# EAGLE design mapleCUx_large_052 (EAGLE 7.3.0)
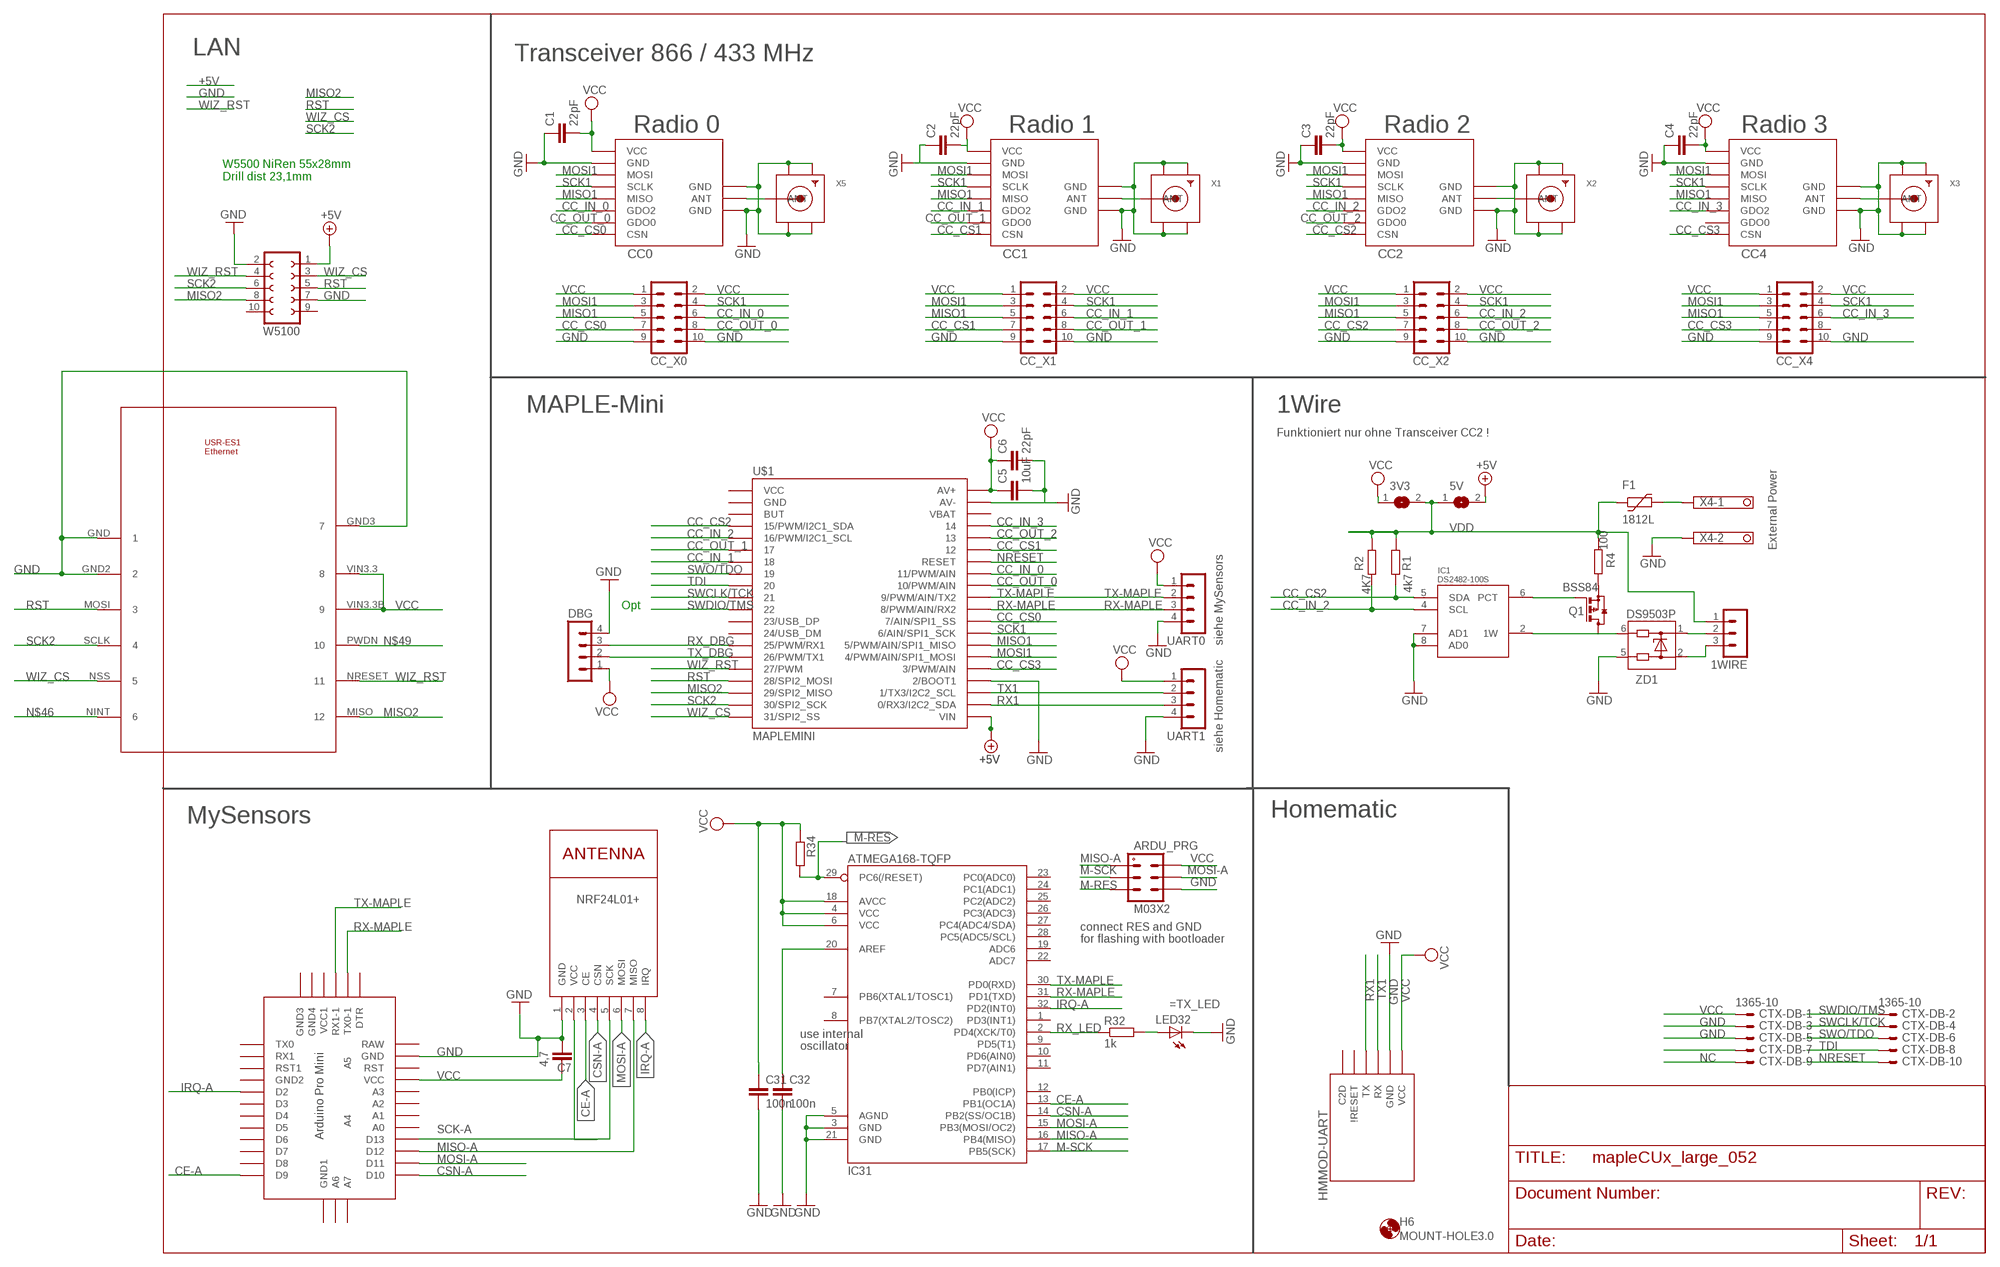
[diagram p0: schematic, sheet 1]

## Parts
1WIRE  MA03-1  [MA03-1]
3V3  SJ  [SJ]
5V  SJ  [SJ]
ARDU_PRG  M03X2  [2X03-1.27MM_SMD]
C1  22pF  C-EUC0805  [C0805]
C2  22pF  C-EUC0805  [C0805]
C3  22pF  C-EUC0805  [C0805]
C4  22pF  C-EUC0805  [C0805]
C5  10uF  C-EUC1210  [C1210]
C6  22pF  C-EUC0805  [C0805]
C7  4,7  C-EUC1210  [C1210]
C31  100n  C-EUC0805  [C0805]
C32  100n  C-EUC0805  [C0805]
CC0  CC1101_MODULE1SMD  [CC1101_MODULE1_SMD]
CC1  CC1101_MODULE1SMD  [CC1101_MODULE1_SMD]
CC2  CC1101_MODULE1SMD  [CC1101_MODULE1_SMD]
CC4  CC1101_MODULE1SMD  [CC1101_MODULE1_SMD]
CC_X0  MA05-2  [MA05-2]
CC_X1  MA05-2  [MA05-2]
CC_X2  MA05-2  [MA05-2]
CC_X4  MA05-2  [MA05-2]
CTX-DB  1365-10  [1365-10]
DBG  MA04-1  [MA04-1]
F1  1812L  [1812L]
H6  MOUNT-HOLE3.0  [3,0]
HMMOD-UART  HM-MOD-UARTDIL  [HM-MOD-UART-DIL]
IC1  DS2482-100S  [SO08]
IC31  ATMEGA168-TQFP  [TQFP32-08]
LED32  LEDCHIPLED_0805  [CHIPLED_0805]
NRF24L01+  NRF24L01+  WIRELESS-NRF24L01  [WIRELESS-NRF24L01]
Q1  BSS84  [SOT23]
R1  4k7  R-EU_R0805  [R0805]
R2  4K7  R-EU_R0805  [R0805]
R4  100  R-EU_R0805  [R0805]
R32  1k  R-EU_R0805  [R0805]
R34  R-EU_R0805  [R0805]
U$1  MAPLEMINI  [20-DIP]
U$2  ABK-PRO-MINI  [ABK-PRO-MINI]
U$3  USR-ES1  [USR-ES1]
UART0  MA04-1  [MA04-1]
UART1  MA04-1  [MA04-1]
W5100  FE05-2  [FE05-2]
X1  SMACONNECTOR_EDGE_UFL  [SMA_EDGELAUNCH_UFL]
X2  SMACONNECTOR_EDGE_UFL  [SMA_EDGELAUNCH_UFL]
X3  SMACONNECTOR_EDGE_UFL  [SMA_EDGELAUNCH_UFL]
X4  1751248  [1751248]
X5  SMACONNECTOR_EDGE_UFL  [SMA_EDGELAUNCH_UFL]
ZD1  DS9503P  [TSOC6]

## Nets
+5V [PWR]: 5V.2 U$1.21(VIN) W5100.1
CC_CS0: CC0.CSN CC_X0.7 U$1.29(7/AIN/SPI1_SS)
CC_CS1: CC1.CSN CC_X1.7 U$1.35
CC_CS2: CC2.CSN CC_X2.7 IC1.5(SDA) R1.2 U$1.4(15/PWM/I2C1_SDA)
CC_CS3: CC4.CSN CC_X4.7 U$1.25(3/PWM/AIN)
CC_IN_0: CC0.GDO2 CC_X0.6 U$1.33(11/PWM/AIN)
CC_IN_1: CC1.GDO2 CC_X1.6 U$1.7
CC_IN_2: CC2.GDO2 CC_X2.6 IC1.4(SCL) R2.2 U$1.5(16/PWM/I2C1_SCL)
CC_IN_3: CC4.GDO2 CC_X4.6 U$1.37
CC_OUT_0: CC0.GDO0 CC_X0.8 U$1.32(10/PWM/AIN)
CC_OUT_1: CC1.GDO0 CC_X1.8 U$1.6
CC_OUT_2: CC2.GDO0 CC_X2.8 U$1.36
CE-A: IC31.13(PB1(OC1A)) NRF24L01+.3(CE) U$2.D9
CSN-A: IC31.14(PB2(SS/OC1B)) NRF24L01+.4(CSN) U$2.D10
GND [PWR]: ARDU_PRG.P$6 C1.1 C2.1 C3.1 C4.1 C5.2 C6.2 C7.1 C31.2 C32.2 CC0.GND@0(GND) CC0.GND@1(GND) CC0.GND@2(GND) CC1.GND@0(GND) CC1.GND@1(GND) CC1.GND@2(GND) CC2.GND@0(GND) CC2.GND@1(GND) CC2.GND@2(GND) CC4.GND@0(GND) CC4.GND@1(GND) CC4.GND@2(GND) CC_X0.9 CC_X0.10 CC_X1.9 CC_X1.10 CC_X2.9 CC_X2.10 CC_X4.9 CC_X4.10 CTX-DB.3 CTX-DB.5 DBG.4 HMMOD-UART.2(GND) IC1.7(AD1) IC1.8(AD0) IC31.3(GND) IC31.5(AGND) IC31.21(GND) LED32.C NRF24L01+.1(GND) U$1.24(2/BOOT1) U$1.39(AV-) U$2.GND U$3.GND U$3.GND2 U$3.GND3 UART0.4 UART1.4 W5100.2 W5100.7 X1.GND@1(GND1) X1.GND@2(GND2) X1.GND@3(GND3) X1.GND@4(GND4) X2.GND@1(GND1) X2.GND@2(GND2) X2.GND@3(GND3) X2.GND@4(GND4) X3.GND@1(GND1) X3.GND@2(GND2) X3.GND@3(GND3) X3.GND@4(GND4) X4.2 X5.GND@1(GND1) X5.GND@2(GND2) X5.GND@3(GND3) X5.GND@4(GND4) ZD1.5
IRQ-A: IC31.32(PD2(INT0)) NRF24L01+.8(IRQ) U$2.D2
M-RES: ARDU_PRG.P$5 IC31.29(PC6(/RESET)) R34.2
M-SCK: ARDU_PRG.P$3 IC31.17(PB5(SCK))
MISO1: CC0.MISO CC1.MISO CC2.MISO CC4.MISO CC_X0.5 CC_X1.5 CC_X2.5 CC_X4.5 U$1.27(5/PWM/AIN/SPI1_MISO)
MISO2: U$1.18(29/SPI2_MISO) U$3.MISO W5100.8
MISO-A: ARDU_PRG.P$1 IC31.16(PB4(MISO)) NRF24L01+.7(MISO) U$2.D12
MOSI1: CC0.MOSI CC1.MOSI CC2.MOSI CC4.MOSI CC_X0.3 CC_X1.3 CC_X2.3 CC_X4.3 U$1.26(4/PWM/AIN/SPI1_MOSI)
MOSI-A: ARDU_PRG.P$4 IC31.15(PB3(MOSI/OC2)) NRF24L01+.6(MOSI) U$2.D11
N$1: CC1.ANT X1.P(ANT)
N$2: CC4.ANT X3.P(ANT)
N$3: CC2.ANT X2.P(ANT)
N$4: CC0.ANT X5.P(ANT)
N$5: LED32.A R32.2
N$8: CTX-DB.7
N$15: C32.1 IC31.20(AREF)
N$21: 1WIRE.2 ZD1.1
N$45 [PWR]: F1.P$2 X4.1
N$46: U$3.NINT
N$47: IC1.6(PCT) Q1.1(G)
N$48: IC1.2(1W) Q1.3(D) ZD1.6
N$49: U$3.PWDN
N$51 [PWR]: 1WIRE.3 ZD1.2
N$52: Q1.2(S) R4.1
NC: CTX-DB.9
NRESET: CTX-DB.10 U$1.34(RESET)
RST: U$1.17(28/SPI2_MOSI) U$3.MOSI W5100.5
RX1: HMMOD-UART.5(TX) U$1.22(0/RX3/I2C2_SDA) UART1.3
RX-MAPLE: IC31.31(PD1(TXD)) U$1.30(8/PWM/AIN/RX2) U$2.TX0-1 UART0.3
RX_DBG: DBG.3 U$1.14(25/PWM/RX1)
RX_LED: IC31.2(PD4(XCK/T0)) R32.1
SCK1: CC0.SCLK CC1.SCLK CC2.SCLK CC4.SCLK CC_X0.4 CC_X1.4 CC_X2.4 CC_X4.4 U$1.28(6/AIN/SPI1_SCK)
SCK2: U$1.19(30/SPI2_SCK) U$3.SCLK W5100.6
SCK-A: NRF24L01+.5(SCK) U$2.D13
SWCLK/TCK: CTX-DB.4 U$1.10
SWDIO/TMS: CTX-DB.2 U$1.11
SWO/TDO: CTX-DB.6 U$1.8
TDI: CTX-DB.8 U$1.9
TX1: HMMOD-UART.6(RX) U$1.23(1/TX3/I2C2_SCL) UART1.2
TX-MAPLE: IC31.30(PD0(RXD)) U$1.31(9/PWM/AIN/TX2) U$2.RX1-1 UART0.2
TX_DBG: DBG.2 U$1.15(26/PWM/TX1)
VCC [PWR]: 3V3.1 ARDU_PRG.P$2 C1.2 C2.2 C3.2 C4.2 C5.1 C6.1 C7.2 C31.1 CC0.VCC CC1.VCC CC2.VCC CC4.VCC CC_X0.1 CC_X0.2 CC_X1.1 CC_X1.2 CC_X2.1 CC_X2.2 CC_X4.1 CC_X4.2 CTX-DB.1 DBG.1 HMMOD-UART.1(VCC) IC31.4(VCC) IC31.6(VCC) IC31.18(AVCC) NRF24L01+.2(VCC) R34.1 U$1.40(AV+) U$2.VCC U$3.VIN3.3 U$3.VIN3.3B UART0.1 UART1.1
VDD [PWR]: 1WIRE.1 3V3.2 5V.1 F1.P$1 R1.1 R2.1 R4.2
WIZ_CS: U$1.20(31/SPI2_SS) U$3.NSS W5100.3
WIZ_RST: U$1.16(27/PWM) U$3.NRESET W5100.4
Unconnected: CC4.GDO0 CC_X4.8 HMMOD-UART.3(C2D) HMMOD-UART.4(\!RESET) IC31.1(PD3(INT1)) IC31.7(PB6(XTAL1/TOSC1)) IC31.8(PB7(XTAL2/TOSC2)) IC31.9(PD5(T1)) IC31.10(PD6(AIN0)) IC31.11(PD7(AIN1)) IC31.12(PB0(ICP)) IC31.19(ADC6) IC31.22(ADC7) IC31.23(PC0(ADC0)) IC31.24(PC1(ADC1)) IC31.25(PC2(ADC2)) IC31.26(PC3(ADC3)) IC31.27(PC4(ADC4/SDA)) IC31.28(PC5(ADC5/SCL)) U$1.1(VCC) U$1.2(GND) U$1.3(BUT) U$1.12(23/USB_DP) U$1.13(24/USB_DM) U$1.38(VBAT) U$2.A0 U$2.A1 U$2.A2 U$2.A3 U$2.A4 U$2.A5 U$2.A6 U$2.A7 U$2.D3 U$2.D4 U$2.D5 U$2.D6 U$2.D7 U$2.D8 U$2.DTR U$2.GND1(GND2) U$2.GND2(GND3) U$2.GND3(GND4) U$2.GND4(GND1) U$2.RAW U$2.RST U$2.RST1 U$2.RX1 U$2.TX0 U$2.VCC1 W5100.9 W5100.10

## Notes on the sheet
- LAN | Transceiver 866 / 433 MHz
- Radio 0 | Radio 1 | Radio 2 | Radio 3
- W5500 NiRen 55x28mm
  Drill dist 23,1mm
- MAPLE-Mini | 1Wire
- Funktioniert nur ohne Transceiver CC2 !
- External Power
- Opt
- siehe MySensors
- siehe Homematic
- MySensors | Homematic
- connect RES and GND
- for flashing with bootloader
- =TX_LED
- use internal
- oscillator

## Power pins joined to a net without a drawn wire
GND: IC1.3(GND)
VDD: IC1.1(VDD)

## Library data of the parts
1WIRE = con-lstb:MA03-1: PIN HEADER; OC_FARNELL: unknown; OC_NEWARK: unknown
3V3 5V = jumper:SJ: SMD solder JUMPER
ARDU_PRG = mechanics:M03X2
C1-C7 C31 C32 = rcl:C-EU: CAPACITOR, European symbol
CC0 CC1 CC2 CC4 = wireless:CC1101_MODULE1: CC1101 wireless module for 433/868 MHz (sold from Aliexpress). DIL version for mounting with pin header (and SMD soldering) and SMD only variant available.
CC_X0 CC_X1 CC_X2 CC_X4 = con-lstb:MA05-2: PIN HEADER; OC_FARNELL: unknown; OC_NEWARK: unknown
CTX-DB = con-leotronics:1365-10: DUAL ROW STRAIGHT HEADER 1364 SERIES. 1.27mm x 1.27mm. Without Fixing Post. SMT Source: http://www.leotronics.co.uk/Conexcon/Data%20Sheets/sec.%20A/1364ing.pdf; OC_FARNELL: unknown; OC_NEWARK: unknown
DBG UART0 UART1 = con-lstb:MA04-1: PIN HEADER; OC_FARNELL: unknown; OC_NEWARK: unknown
F1 = ptc-littlefuse:1812L
H6 = holes:MOUNT-HOLE: MOUNTING HOLE with drill center marker
HMMOD-UART = wireless:HM-MOD-UART: eQ3 HM-MOD-UART-AW-SH2 wireless module for 868 MHz. DIL version for mounting with pin header (antenna upwards) and SMD variant available (antenna downwards).
IC1 = 1wire:DS2482-100: I2C to 1-Wire Host Adapter/Line Driver This device is a onewire host and I2C interface in one chip. It provides the complete DC/AC requirements for onewire communication, including overdrive speed mode, but, unlike the DS2480B chip, no 12V EPROM programming. Notes: For overdrive speed and 5V EEPROM programming, an external active pullup circuit must be connected to the 1W, VDD and PCT pin. See the datasheet for details. The lower two I2C adress bits of the chip can be selected by external pins, so up to 4 chips may be connected to the same I2C bus. Author: Orginal device and description from Giovanni Varasano <giovanni.varasano@fastwebnet.it> Improved by Jan Kandziora <jjj@gmx.de>
IC31 = atmel:ATMEGA168: Atmel Atmega 168/328/328P
LED32 = led:LED: LED OSRAM: - CHIPLED LG R971, LG N971, LY N971, LG Q971, LY Q971, LO R971, LY R971 LH N974, LH R974 LS Q976, LO Q976, LY Q976 LO Q996 - Hyper CHIPLED LW Q18S LB Q993, LB Q99A, LB R99A - SideLED LS A670, LO A670, LY A670, LG A670, LP A670 LB A673, LV A673, LT A673, LW A673 LH A674 LY A675 LS A676, LA A676, LO A676, LY A676, LW A676 LS A679, LY A679, LG A679 - Hyper Micro SIDELED® LS Y876, LA Y876, LO Y876, LY Y876 LT Y87S - SmartLED LW L88C, LW L88S LB L89C, LB L89S, LG L890 LS L89K, LO L89K, LY L89K LS L896, LA L896, LO L896, LY L896 - TOPLED LS T670, LO T670, LY T670, LG T670, LP T670 LSG T670, LSP T670, LSY T670, LOP T670, LYG T670 LG T671, LOG T671, LSG T671 LB T673, LV T673, LT T673, LW T673 LH T674 LS T676, LA T676, LO T676, LY T676, LB T676, LH T676, LSB T676, LW T676 LB T67C, LV T67C, LT T67C, LS T67K, LO T67K, LY T67K, LW E67C LS E67B, LA E67B, LO E67B, LY E67B, LB E67C, LV E67C, LT E67C LW T67C LS T679, LY T679, LG T679 LS T770, LO T770, LY T770, LG T770, LP T770 LB T773, LV T773, LT T773, LW T773 LH T774 LS E675, LA E675, LY E675, LS T675 LS T776, LA T776, LO T776, LY T776, LB T776 LHGB T686 LT T68C, LB T68C - Hyper Mini TOPLED® LB M676 - Mini TOPLED Santana® LG M470 LS M47K, LO M47K, LY M47K Source: http://www.osram.convergy.de LUXEON: - LUMILED® LXK2-PW12-R00, LXK2-PW12-S00, LXK2-PW14-U00, LXK2-PW14-V00 LXK2-PM12-R00, LXK2-PM12-S00, LXK2-PM14-U00 LXK2-PE12-Q00, LXK2-PE12-R00, LXK2-PE12-S00, LXK2-PE14-T00, LXK2-PE14-U00 LXK2-PB12-K00, LXK2-PB12-L00, LXK2-PB12-M00, LXK2-PB14-N00, LXK2-PB14-P00, LXK2-PB14-Q00 LXK2-PR12-L00, LXK2-PR12-M00, LXK2-PR14-Q00, LXK2-PR14-R00 LXK2-PD12-Q00, LXK2-PD12-R00, LXK2-PD12-S00 LXK2-PH12-R00, LXK2-PH12-S00 LXK2-PL12-P00, LXK2-PL12-Q00, LXK2-PL12-R00 Source: www.luxeon.com KINGBRIGHT: KA-3528ASYC Source: www.kingbright.com
NRF24L01+ = diy-modules:WIRELESS-NRF24L01: 2.4 GHz Wireless Module based on NRF24L01 chip
Q1 = transistor-small-signal:BSS84: P-CHANNEL MOS FET
R1 R2 R4 R32 R34 = rcl:R-EU_: RESISTOR, European symbol
U$1 = maplemini-small:MAPLEMINI
U$2 = Arduino-clone:ABK-PRO-MINI: ABK Pro-Mini Arduino Clone
U$3 = Martin:USR-ES1: W5500 LAN Module
W5100 = con-lsta:FE05-2: FEMALE HEADER; OC_FARNELL: unknown; OC_NEWARK: unknown
X1-X3 X5 = adafruit:SMACONNECTOR: SMA Connector 90° DIP SMA Connector, 50 Ohm (4UConnector: 07259)
X4 = con-phoenix-350:1751248: MKDS 1/ 2-3,5 Printklemme Nennstrom: 10 A Bemessungsspannung: 160 V Raster: 3,5 mm Polzahl: 2 Montageart: Löten Anschlussart: Schraubanschluss Anschlussrichtung vom Leiter zur Platine: 0° Source: http://eshop.phoenixcontact.com .. 1751248.pdf; OC_FARNELL: unknown; OC_NEWARK: unknown
ZD1 = 1wire:DS9503: ESD Protection Diode with Resistors This ESD protection diode is designed especially for onewire host interfaces. Unlike the DS9502, it has two additional 5Ohm resitors in the 1W and GND line. Pin 5 and 6 have to be connected to the host side, pin 1 und 2 to the network side. The 1W line is through pin 1 and 6, the GND line is through pin 2 and 5. Author: Jan Kandziora <jjj@gmx.de>

## Net classes
1 PWR: width 0.508 mm

## Board
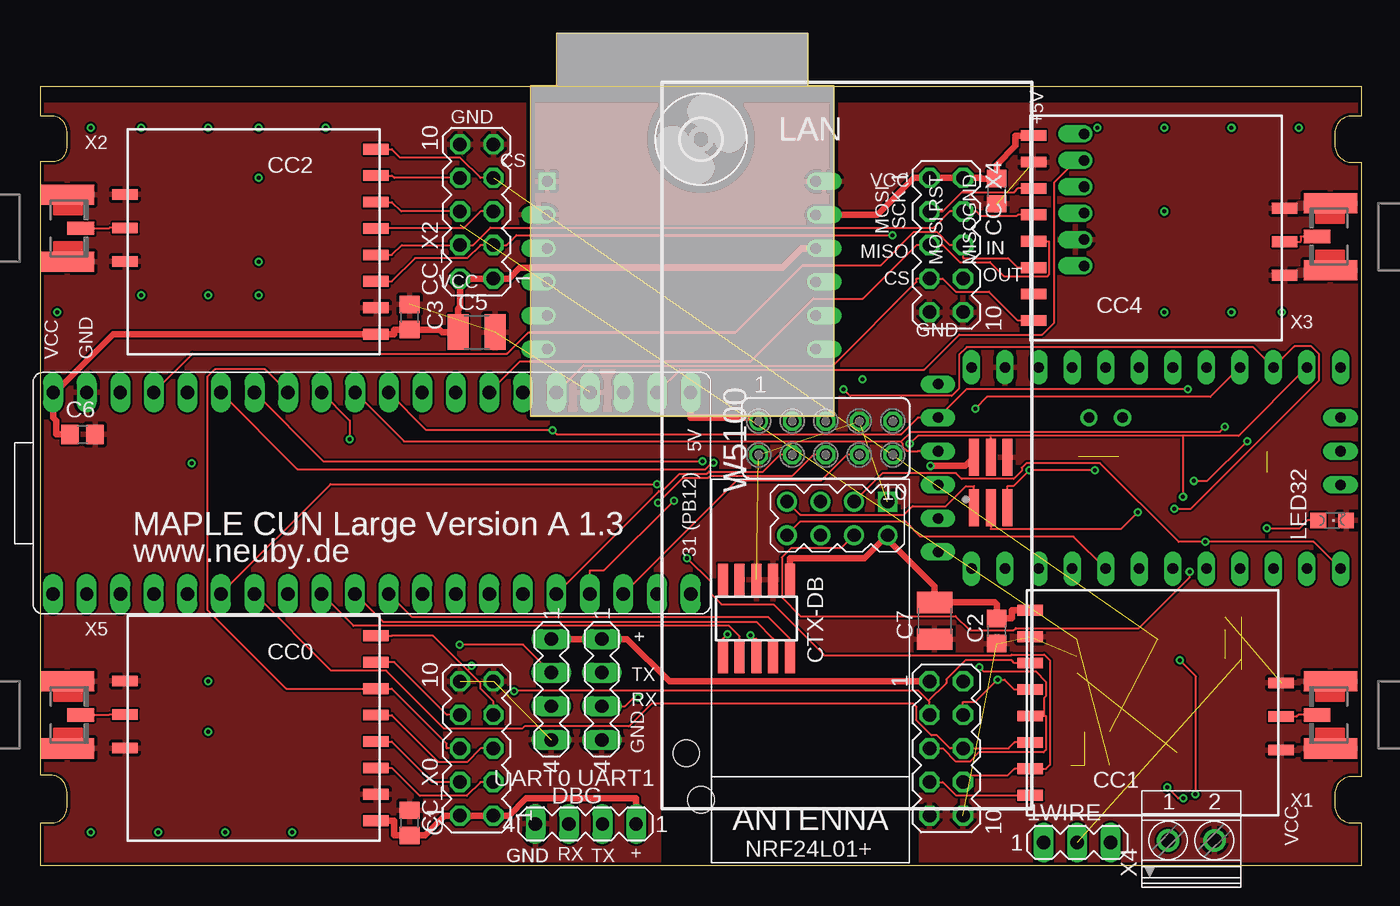
[diagram p1: board, top side]
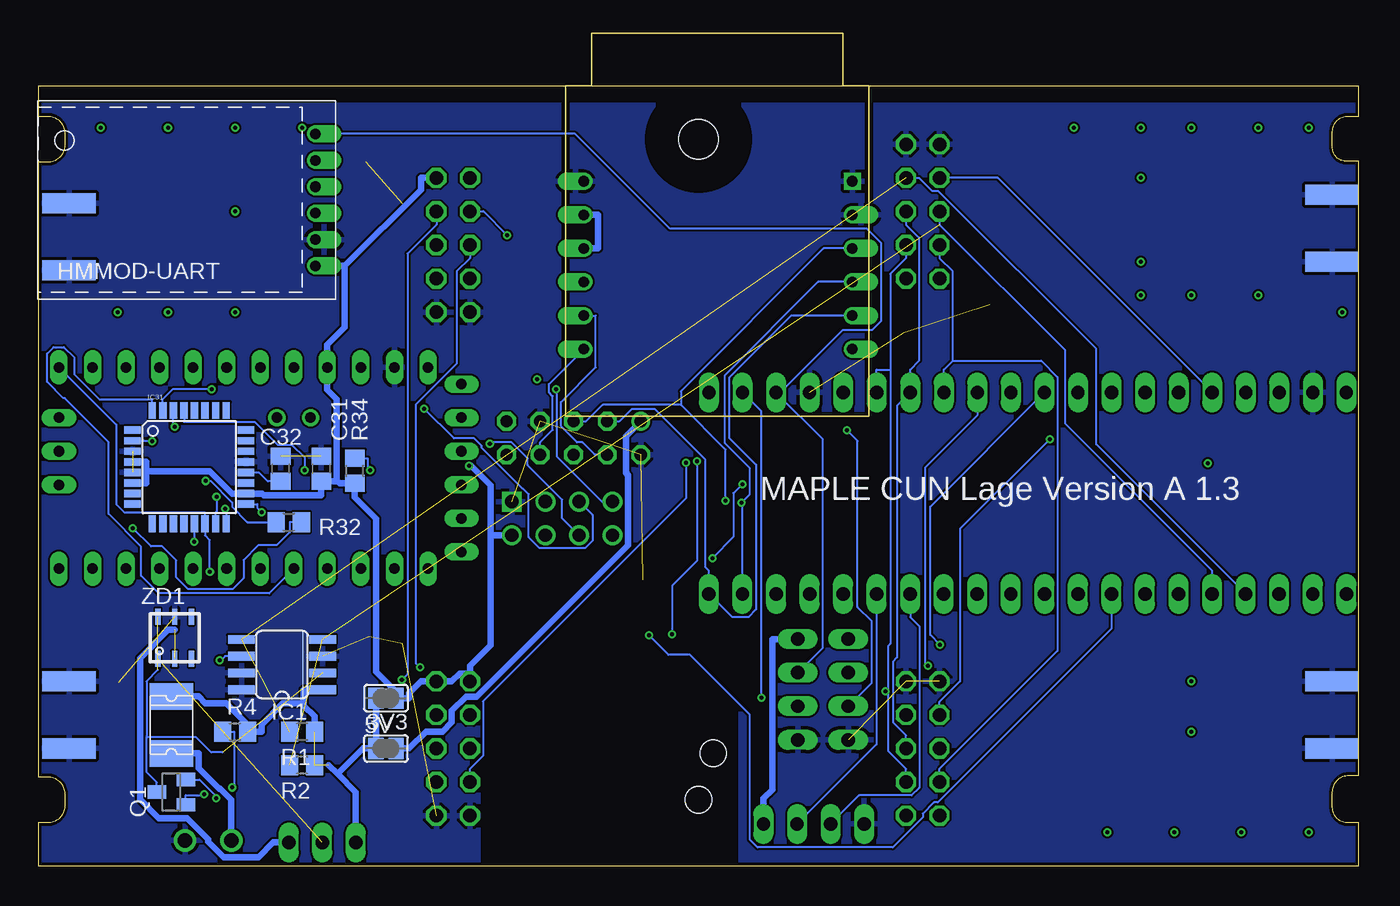
[diagram p2: board, bottom side, seen from below]

Size 100 x 59 mm. Coordinates in mm from the lower left corner, seen from the top.
Outline: 0,0 0,3.25 0.84,3.25 arc90 2,4.41 2,5.59 arc90 0.76,6.86 0,6.86 0,53.34 1.02,53.34 arc90 2,54.41 2,55.59 arc90 0.84,56.75 0,56.75 0,59 100,59 100,56.75 99.41,56.75 arc90 98,55.59 98,54.41 arc90 99.41,53.25 100,53.25 100,6.75 99.41,6.75 arc90 98,5.59 98,4.41 arc90 99.41,3.25 100,3.25 100,0 0,0
Copper layers (1*16): Top 0.035mm / dielectric 1.5mm / Bottom 0.035mm
Design rules "SeeedStudio_2layer_DRU_no_angle_20140221": minimum track width 6mil, minimum drill 12mil, track to track 6mil, track to pad 6mil, pad to pad 6mil, via to via 6mil, smd to smd 0mil, copper to edge 10mil, drill to drill 10mil, minimum pad ring 10mil, minimum via ring 6mil, stop-mask expansion 2mil, vias tented up to drill 100mil, thermal gap 10mil
Holes 2 mm at 48.9,8.53 50,5
tRestrict: area 0,58 to 100,59; area 47,0 to 66,12
bRestrict: area 0,58 to 100,59; area 0,58 to 100,59; area 47,0 to 66,12

### Footprints (pad centres in the part's own frame; a part is rotated, then mirrored left to right if it is on the bottom)
MA03-1 = drill 1.016 long: 1 -2.54,0; 2 0,0; 3 2.54,0
SJ = smd 1.168 x 1.6: 1 -0.762,0; 2 0.762,0
2X03-1.27MM_SMD = smd 0.75 x 2.8: P$1 -1.27,-1.905; P$2 -1.27,1.905; P$3 0,-1.905; P$4 0,1.905; P$5 1.27,-1.905; P$6 1.27,1.905
C0805 = smd 1.3 x 1.5: 1 -0.95,0; 2 0.95,0
C1210 = smd 1.6 x 2.7: 1 -1.4,0; 2 1.4,0
CC1101_MODULE1_SMD = smd 1.93 x 0.813: ANT 19,5.96; CSN 0,0; GDO0 0,2; GDO2 0,4; GND@0 0,12; GND@1 19,8.5; GND@2 19,3.42; MISO 0,6; MOSI 0,10; SCLK 0,8; VCC 0,14
MA05-2 = drill 1.016 octagon: 1 -5.08,-1.27; 2 -5.08,1.27; 3 -2.54,-1.27; 4 -2.54,1.27; 5 0,-1.27; 6 0,1.27; 7 2.54,-1.27; 8 2.54,1.27; 9 5.08,-1.27; 10 5.08,1.27
1365-10 = smd 0.76 x 2.4: 1 -2.54,-2.95; 2 -2.54,2.95; 3 -1.27,-2.95; 4 -1.27,2.95; 5 0,-2.95; 6 0,2.95; 7 1.27,-2.95; 8 1.27,2.95; 9 2.54,-2.95; 10 2.54,2.95
MA04-1 = drill 1.016 long: 1 -3.81,0; 2 -1.27,0; 3 1.27,0; 4 3.81,0
1812L = smd 2.03 x 3.3: P$1 -2.16,0; P$2 2.16,0
3,0 = hole 3: 0,0
HM-MOD-UART-DIL = drill 0.8 offset: 1 0,12; 2 0,10; 3 0,8; 4 0,6; 5 0,4; 6 0,2
SO08 = smd 0.66 x 2.032: 1 -1.905,-3.073; 2 -0.635,-3.073; 3 0.635,-3.073; 4 1.905,-3.073; 5 1.905,3.073; 6 0.635,3.073; 7 -0.635,3.073; 8 -1.905,3.073
TQFP32-08 = smd 1.27 x 0.559: 1 -4.293,2.8; 2 -4.293,2; 3 -4.293,1.2; 4 -4.293,0.4; 5 -4.293,-0.4; 6 -4.293,-1.2; 7 -4.293,-2; 8 -4.293,-2.8; 17 4.293,-2.8; 18 4.293,-2; 19 4.293,-1.2; 20 4.293,-0.4; 21 4.293,0.4; 22 4.293,1.2; 23 4.293,2; 24 4.293,2.8 | smd 0.559 x 1.27: 9 -2.8,-4.293; 10 -2,-4.293; 11 -1.2,-4.293; 12 -0.4,-4.293; 13 0.4,-4.293; 14 1.2,-4.293; 15 2,-4.293; 16 2.8,-4.293; 25 2.8,4.293; 26 2,4.293; 27 1.2,4.293; 28 0.4,4.293; 29 -0.4,4.293; 30 -1.2,4.293; 31 -2,4.293; 32 -2.8,4.293
CHIPLED_0805 = smd 1.2 x 1.2: A 0,-1.05; C 0,1.05
WIRELESS-NRF24L01 = drill 1 square: 1 -12.7,6.35 | drill 1: 2 -10.16,6.35; 3 -12.7,3.81; 4 -10.16,3.81; 5 -12.7,1.27; 6 -10.16,1.27; 7 -12.7,-1.27; 8 -10.16,-1.27
SOT23 = smd 1 x 1.4: 1 -0.95,-1.1; 2 0.95,-1.1; 3 0,1.1
R0805 = smd 1.3 x 1.5: 1 -0.95,0; 2 0.95,0
20-DIP = drill 1.016 pad 1.27 long: 1 -24.13,-7.62; 2 -21.59,-7.62; 3 -19.05,-7.62; 4 -16.51,-7.62; 5 -13.97,-7.62; 6 -11.43,-7.62; 7 -8.89,-7.62; 8 -6.35,-7.62; 9 -3.81,-7.62; 10 -1.27,-7.62; 11 1.27,-7.62; 12 3.81,-7.62; 13 6.35,-7.62; 14 8.89,-7.62; 15 11.43,-7.62; 16 13.97,-7.62; 17 16.51,-7.62; 18 19.05,-7.62; 19 21.59,-7.62; 20 24.13,-7.62 | drill 1 pad 1.27 long: 21 24.13,7.62; 22 21.59,7.62; 23 19.05,7.62; 24 16.51,7.62; 25 13.97,7.62; 26 11.43,7.62; 27 8.89,7.62; 28 6.35,7.62; 29 3.81,7.62; 30 1.27,7.62; 31 -1.27,7.62; 32 -3.81,7.62; 33 -6.35,7.62; 34 -8.89,7.62; 35 -11.43,7.62; 36 -13.97,7.62; 37 -16.51,7.62; 38 -19.05,7.62; 39 -21.59,7.62; 40 -24.13,7.62
ABK-PRO-MINI = drill 0.8 long: A0 10.16,-3.81; A1 10.16,-6.35; A2 10.16,-8.89; A3 10.16,-11.43; A6 3.81,-21.59; A7 6.35,-21.59; D2 -5.08,-3.81; D3 -5.08,-6.35; D4 -5.08,-8.89; D5 -5.08,-11.43; D6 -5.08,-13.97; D7 -5.08,-16.51; D8 -5.08,-19.05; D9 -5.08,-21.59; D10 10.16,-21.59; D11 10.16,-19.05; D12 10.16,-16.51; D13 10.16,-13.97; DTR 8.89,8.89; GND 10.16,3.81; GND1 -5.08,-1.27; GND2 -3.81,8.89; GND3 -1.27,8.89; GND4 1.27,-21.59; RAW 10.16,6.35; RST 10.16,1.27; RST1 -5.08,1.27; RX1 -5.08,3.81; RX1-1 3.81,8.89; TX0 -5.08,6.35; TX0-1 6.35,8.89; VCC 10.16,-1.27; VCC1 1.27,8.89 | drill 0.8: A4 6.35,-5.08; A5 6.35,-2.54
USR-ES1 = drill 0.8 square: GND 1.27,17.78 | drill 0.8 offset: GND2 1.27,15.24; GND3 21.59,17.78; MISO 21.59,5.08; MOSI 1.27,12.7; NINT 1.27,5.08; NRESET 21.59,7.62; NSS 1.27,7.62; PWDN 21.59,10.16; SCLK 1.27,10.16; VIN3.3 21.59,15.24; VIN3.3B 21.59,12.7
FE05-2 = drill 0.914: 1 -5.08,1.27 | drill 0.914 octagon: 2 -5.08,-1.27; 3 -2.54,1.27; 4 -2.54,-1.27; 5 0,1.27; 6 0,-1.27; 7 2.54,1.27; 8 2.54,-1.27; 9 5.08,1.27; 10 5.08,-1.27
SMA_EDGELAUNCH_UFL = smd 4.064 x 1.524: GND@1 2.032,-2.54; GND@2 2.032,2.54 | smd 4.064 x 1.524 bottom: GND@3 2.032,2.54; GND@4 2.032,-2.54 | smd 2.032 x 1.016: P 3.048,0
1751248 = drill 1.1 pad 1.7: 1 -1.75,-0.1; 2 1.75,-0.1
TSOC6 = smd 0.406 x 1.219: 1 -1.27,-1.6; 2 0,-1.6; 3 1.27,-1.6; 4 1.27,1.6; 5 0,1.6; 6 -1.27,1.6

### Placement (x,y rotation side)
1WIRE  78.49,1.78 0 top
3V3  73.66,12.7 180 bottom
5V  73.66,8.89 0 bottom
ARDU_PRG  71.94,29.02 0 top
C1  27.94,3.25 270 top
C2  72.39,17.78 90 top
C3  27.94,41.55 270 top
C4  72.39,51.07 90 top
C5  33.02,40.4 0 top
C6  3.17,32.66 0 top
C7  67.69,18.54 90 top
C31  78.56,30.06 90 bottom
C32  81.64,30.06 90 bottom
CC0  25.4,17.41 180 top
CC1  74.93,5.35 0 top
CC2  25.4,54.24 180 top
CC4  75.18,41.27 0 top
CC_X0  33.02,8.89 90 top
CC_X1  68.58,8.89 270 top
CC_X2  33.02,49.53 90 top
CC_X4  68.58,46.99 270 top
CTX-DB  54.19,18.73 180 top
DBG  41.27,3.17 180 top
F1  89.92,10.67 270 bottom
H6  50,55 0 top
HMMOD-UART  78.99,57.4 180 bottom
IC1  81.53,15.24 90 bottom
IC31  88.56,30.18 0 bottom
LED32  97.79,26.14 270 top
NRF24L01+  57.78,14.88 270 top
Q1  89.92,5.59 90 bottom
R1  80.01,10.16 180 bottom
R2  80.01,7.62 180 bottom
R4  85.09,10.16 0 bottom
R32  81.02,26.02 0 bottom
R34  76.02,29.9 90 bottom
U$1  25.08,28.21 0 top
U$2  76.83,27.57 90 top
U$3  37.08,34.04 0 top
UART0  38.66,13.36 270 top
UART1  42.49,13.36 270 top
W5100  59.45,32.38 0 top
X1  99.69,11.43 180 top
X2  0,48.26 0 top
X3  99.69,47.62 180 top
X4  87.12,2.03 0 top
X5  0,11.43 0 top
ZD1  89.66,17.27 0 bottom

### Tracks (layer width: path | path; a pad name or v marks a point on that pad's centre or on a via)
+5V
  Top 0.508: W5100.1 54.11,33.92 49.21,33.92 U$1.21
  Bottom 0.508: 5V.2 71.91,8.89 70.64,10.16 69.39,10.16 68.68,10.86 68.68,11.73 67.61,12.8 66.8,12.8 55.33,24.28 55.33,29.58 55.49,29.75 55.49,32.54 W5100.1
CC_CS0  (via drill 0.3 pad 0.61)
  Top 0.152: 32.31,14.81 29.71,17.41 26.59,17.41 CC0.CSN | 32.31,14.81 33.3,13.83 33.3,13.41 34.29,12.42 CC_X0.7 | 32.31,14.81 v32.64,15.15
  Bottom 0.152: v32.64,15.15 32.81,15.31 32.81,30.18 28.89,34.09 U$1.29
CC_CS1  (via drill 0.3 pad 0.61)
  Top 0.152: CC_X1.7 68.3,6.35 69.3,5.35 CC1.CSN | U$1.35 19.44,30.04 50.36,30.04 50.84,30.52 v50.95,30.52
  Bottom 0.152: CC_X1.7 67.31,7.34 66.32,8.33 66.32,12.46 50.95,27.82 v50.95,30.52
CC_CS2  (2 unrouted)
  Top 0.152: CC2.CSN 26.59,54.24 27.23,53.61 31.76,53.61 33.3,52.07 CC_X2.7
  Bottom 0.152: CC_X2.7 33.3,52.07 32.31,51.08 31.85,51.08 19.89,39.12 19.89,31.91 U$1.4
CC_CS3
  Top 0.152: U$1.25 41.09,37.87 59.99,37.87 66.32,44.2 66.32,44.45 CC_X4.7 68.3,44.45 69.29,43.46 71.81,43.46 73.99,41.27 CC4.CSN
CC_IN_0
  Top 0.152: U$1.33 16.99,37.58 13.18,37.58 12.63,37.02 12.63,19.38 18.6,13.41 CC0.GDO2 26.59,13.41 30.76,9.25 30.76,8.89 CC_X0.6
CC_IN_1
  Top 0.152: U$1.7 22,14.78 26.17,14.78 30.56,10.38 36.46,10.38 36.63,10.56 44.55,10.56 46.26,12.26 66.09,12.26 66.32,12.03 66.32,11.02 67.46,9.88 67.87,9.88 68.86,8.89 CC_X1.6 73.28,8.89 73.74,9.35 CC1.GDO2
CC_IN_2  (2 unrouted)
  Top 0.152: CC2.GDO2 26.59,50.24 27.31,49.53 CC_X2.6
  Bottom 0.152: U$1.5 11.11,22.34 22.26,33.49 22.26,39.05 31.75,48.54 CC_X2.6
CC_IN_3
  Top 0.152: U$1.37 11.51,38.77 35.31,38.77 36.93,40.39 52.63,40.39 57.71,45.47 63.61,45.47 66.12,47.98 67.87,47.98 68.86,46.99 CC_X4.6 69.85,46 73.27,46 73.99,45.27 CC4.GDO2
CC_OUT_0  (via drill 0.3 pad 0.61)
  Top 0.152: U$1.32 23.4,33.7 v23.4,32.3 | CC_X0.8 30.76,11.43 26.77,15.41 CC0.GDO0
  Bottom 0.152: CC_X0.8 31.75,12.42 30.2,13.97 30.2,25.5 v23.4,32.3
CC_OUT_1  (via drill 0.3 pad 0.61)
  Top 0.152: v48.96,23.3 50.76,21.49 50.76,20.59 51.55,19.8 55.48,19.8 59.35,15.93 73.47,15.93 73.52,15.98 76,15.98 76.43,15.55 76.43,7.66 76.12,7.35 CC1.GDO0 73.74,7.35 73.23,6.84 69.85,6.84 CC_X1.8 | U$1.6 21.95,28.89 v46.69,28.89
  Bottom 0.152: v46.69,28.89 47.36,28.22 47.36,24.9 v48.96,23.3
CC_OUT_2
  Top 0.152: CC2.GDO0 26.59,52.24 26.77,52.07 CC_X2.8
  Bottom 0.152: U$1.36 27.35,52.07 CC_X2.8
CE-A  (via drill 0.3 pad 0.61)
  Top 0.152: NRF24L01+.3 63.75,29.73 69.3,29.73 69.74,29.3 73.68,29.3 74.29,29.91 74.29,30.14 74.64,30.49 80.2,30.49 86.17,24.53 v88.2,24.53 96.39,24.53 U$2.D9
  Bottom 0.152: v88.2,24.53 88.16,24.57 IC31.13
CSN-A  (via drill 0.3 pad 0.61)
  Top 0.152: NRF24L01+.4 60.61,24.05 56.82,24.05 56.12,23.36 56.12,20.32 57.53,18.91 69.28,18.91 70.35,17.84 73.67,17.84 73.83,18 83.14,18 87,21.86 v87,22.28
  Bottom 0.152: U$2.D10 94.08,33.39 94.08,27.37 93.47,26.75 87.36,26.75 IC31.14 87.36,25.02 87,24.66 v87,22.28
GND  (14 unrouted)
  pour Bottom: 0,59 0.13,0 46.99,0 46.99,13.97 66.67,13.97 66.67,0 100,0 100,59
  pour Top: 0.13,0 0,59 100,59 100,0 66.67,0 66.67,13.97 46.99,13.97 46.99,0
IRQ-A
  Top 0.152: U$2.D2 78.21,24.93 66.63,24.93 65.52,26.03 57.51,26.03 NRF24L01+.8
  Bottom 0.152: IC31.32 91.36,35.34 95.39,35.34 97.26,37.21 97.26,38.48 98.05,39.27 98.83,39.27 99.33,38.77 99.33,36.63 98.1,35.4 97.98,35.4 94.67,32.08 94.67,26.64 92.2,24.17 92.2,21.96 90.88,20.64 82.5,20.64 U$2.D2
M-RES  (via drill 0.3 pad 0.61)
  Top 0.152: v79.84,29.95 v74.86,29.95 73.65,28.74 73.21,28.74 ARDU_PRG.P$5
  Bottom 0.152: IC31.29 88.96,33.61 83.59,33.61 81.87,31.89 80.8,31.89 79.84,30.93 v79.84,29.95 | R34.2 75.04,30.85 75.04,30.14 v74.86,29.95
M-SCK  (via drill 0.3 pad 0.61)
  Top 0.152: ARDU_PRG.P$3 71.94,25.49 81.8,25.49 v83.08,26.77
  Bottom 0.152: IC31.17 83.4,27.38 83.4,27.09 v83.08,26.77
MISO1  (via drill 0.3 pad 0.61)
  Top 0.152: 75.97,11.35 76.12,11.35 76.12,8.78 75.92,8.59 71.03,8.59 70.35,7.9 69.29,7.9 68.3,8.89 CC_X1.5 | CC1.MISO 75.97,11.35 | v71.08,15.02 71.39,14.71 75.34,14.71 76.12,13.93 76.12,12.85 75.97,12.7 75.97,11.35 | U$1.27 36.32,38.18 53.73,38.18 58.48,42.93 62.26,42.93 66.32,46.99 CC_X4.5 68.3,46.99 69.6,45.69 71.89,45.69 72.94,44.64 76.26,44.64 76.38,44.76 76.38,47.27 CC4.MISO | CC0.MISO 26.59,11.41 30.14,7.86 32.27,7.86 33.3,8.89 CC_X0.5 | CC2.MISO 32.01,48.24 33.3,49.53 CC_X2.5
  Bottom 0.152: CC_X4.5 67.31,46 68.3,45.01 68.3,38.02 71.41,34.91 71.41,15.35 v71.08,15.02 | CC_X2.5 34.29,48.54 33.3,47.55 33.3,38.24 33.97,37.57 U$1.27 34.96,34.84 34.96,15.79 35.28,15.47 35.28,10.87 34.29,9.88 CC_X0.5
MISO2
  Top 0.152: W5100.8 61.05,31.11 59.11,29.18 52.72,29.18 U$1.18
  Bottom 0.152: U$3.MISO 61.34,36.45 61.34,35.84 61.05,35.56 61.05,32.99 61.99,32.05 W5100.8
MISO-A  (via drill 0.3 pad 0.61)
  Top 0.152: ARDU_PRG.P$1 70.67,28.74 70.07,28.74 68.55,27.23 66.02,27.23 65.38,26.59 57.5,26.59 NRF24L01+.7 | v60.8,36.06 61.29,35.58 68.99,35.58 69.55,36.13 69.55,38.7 70.12,39.27 91.81,39.27 U$2.D12 94.93,39.32 96.22,39.32 96.81,38.74 96.81,36.74 87.09,27.03 v85.84,27.03
  Bottom 0.152: v60.8,36.06 60.74,36 60.74,31.02 57.29,27.57 NRF24L01+.7 | v85.84,27.03 85.76,26.95 IC31.16
MOSI1  (via drill 0.3 pad 0.61)
  Top 0.152: 67.24,12.49 68.58,13.84 68.58,14.12 70.01,15.55 73.53,15.55 73.74,15.35 CC1.MOSI | v35.85,13.22 35.91,13.29 66.44,13.29 67.24,12.49 | 67.24,12.49 | 67.24,12.49 67.31,12.42 CC_X1.3 | CC4.MOSI 73.99,51.27 73.71,51 69.77,51 68.3,49.53 CC_X4.3 | CC0.MOSI 26.59,7.42 28.7,5.31 32.26,5.31 33.3,6.35 CC_X0.3 | v64.48,47.74 36.03,47.74 35.28,46.99 CC_X2.3 33.8,46.99 33.3,46.99 32.31,46 28.35,46 26.59,44.24 CC2.MOSI
  Bottom 0.152: 35.66,13.22 35.66,8.71 34.29,7.34 CC_X0.3 | 35.48,37.57 35.48,16.82 35.66,16.64 35.66,13.22 | 35.66,13.22 v35.85,13.22 | v64.48,47.74 66.27,49.53 66.32,49.53 CC_X4.3 | 35.48,37.57 35.48,44.81 34.29,46 CC_X2.3 | 35.48,37.57 36.51,37.57 U$1.26
MOSI-A  (via drill 0.3 pad 0.61)
  Top 0.152: 71.94,32.55 66.42,32.55 v65.8,31.94 | ARDU_PRG.P$4 71.94,32.55 | 86.5,32.55 71.94,32.55 | U$2.D11 90.7,32.55 86.5,32.55 | 86.5,32.55 v86.5,27.93
  Bottom 0.152: NRF24L01+.6 60.33,26.3 60.33,27.73 62.93,30.34 62.93,30.84 64.16,32.07 65.67,32.07 v65.8,31.94 | IC31.15 86.56,26.75 86.5,26.81 v86.5,27.93
N$1
  Top 0.152: CC1.ANT 95.12,11.31 95.24,11.43 X1.P
N$2
  Top 0.152: X3.P 95.4,47.62 95.4,47.26 95.38,47.23 CC4.ANT
N$3
  Top 0.152: CC2.ANT 5.21,48.28 5.18,48.26 X2.P
N$4
  Top 0.152: CC0.ANT 5.21,11.46 5.18,11.43 X5.P
N$5  (via drill 0.3 pad 0.61)
  Top 0.152: LED32.A 95.91,26.14 95.34,25.57 v92.83,25.57
  Bottom 0.152: R32.2 80.95,26.02 80.95,25.25 81.93,24.27 83.33,24.27 84.45,23.14 84.45,21.78 85.28,20.96 88.66,20.96 89.53,21.84 89.53,23.13 90.59,24.18 91.44,24.18 v92.83,25.57
N$6  (via drill 0.3 pad 0.61)
  other vias: 3.81,55.88
N$7  (via drill 0.3 pad 0.61)
  other vias: 1.27,41.91
N$9  (via drill 0.3 pad 0.61)
  other vias: 3.81,2.54
N$10  (via drill 0.3 pad 0.61)
  other vias: 8.89,2.54
N$11  (via drill 0.3 pad 0.61)
  other vias: 13.97,2.54
N$12  (via drill 0.3 pad 0.61)
  other vias: 19.05,2.54
N$13  (via drill 0.3 pad 0.61)
  other vias: 7.62,55.88
N$14  (via drill 0.3 pad 0.61)
  other vias: 12.7,55.88
N$15
  Bottom 0.152: C32.1 82.62,29.11 83.29,29.78 IC31.20
N$16  (via drill 0.3 pad 0.61)
  other vias: 95.25,55.88
N$17  (via drill 0.3 pad 0.61)
  other vias: 90.17,55.88
N$18  (via drill 0.3 pad 0.61)
  other vias: 85.09,55.88
N$19  (via drill 0.3 pad 0.61)
  other vias: 80.01,55.88
N$20  (via drill 0.3 pad 0.61)
  other vias: 85.09,41.91
N$21  (1 unrouted)
N$24  (via drill 0.3 pad 0.61)
  other vias: 90.17,41.91
N$26  (via drill 0.3 pad 0.61)
  other vias: 62.23,36.83
N$27  (via drill 0.3 pad 0.61)
  other vias: 16.51,45.72
N$28  (via drill 0.3 pad 0.61)
  other vias: 12.7,13.97
N$29  (via drill 0.3 pad 0.61)
  other vias: 11.43,30.48
N$30  (via drill 0.3 pad 0.61)
  other vias: 85.09,49.53
N$35  (via drill 0.3 pad 0.61)
  other vias: 16.51,43.18
N$36  (via drill 0.3 pad 0.61)
  other vias: 21.59,55.88
N$37  (via drill 0.3 pad 0.61)
  other vias: 16.51,55.88
N$38  (via drill 0.3 pad 0.61)
  other vias: 12.7,10.16
N$39  (via drill 0.3 pad 0.61)
  other vias: 93.98,41.91
N$40  (via drill 0.3 pad 0.61)
  other vias: 16.51,52.07
N$41  (via drill 0.3 pad 0.61)
  other vias: 12.7,43.18
N$42  (via drill 0.3 pad 0.61)
  other vias: 7.62,43.18
N$45
  Bottom 0.508: X4.1 85.37,4.99 86.21,5.83 86.31,5.83 87.86,7.38 87.86,8.51 F1.P$2
N$47  (via drill 0.3 pad 0.61)
  Top 0.152: v87.43,5.44 87.48,5.48 87.48,14.34 v86.25,15.57
  Bottom 0.152: Q1.1 88.82,5.37 87.5,5.37 v87.43,5.44 | IC1.6 85.85,15.88 86.16,15.57 v86.25,15.57
N$48  (2 unrouted)
  Bottom 0.152: 91.72,9.76 91.81,9.67 91.81,7.11 91.02,6.32 Q1.3 | 86.04,8.6 86.89,8.6 88.05,9.76 91.72,9.76 | 90.93,14.83 91.8,13.97 91.8,9.83 91.72,9.76
N$51  (1 unrouted)
  Bottom 0.508: 89.66,17.86 90.16,17.86 92.29,15.73 92.29,5.05 90.85,3.62 88.73,3.62 87.12,2.01 87.12,1.83 85.96,0.66 83.31,0.66 82.19,1.78 1WIRE.3
N$52  (via drill 0.3 pad 0.61)
  Top 0.152: v86.5,5.12 86.12,5.12 v85.31,5.93
  Bottom 0.152: Q1.2 87.78,6.54 86.5,5.26 v86.5,5.12 | R4.1 85.16,10.16 85.16,6.08 v85.31,5.93
NRESET  (via drill 0.3 pad 0.61)
  Top 0.152: CTX-DB.10 51.65,17.2 51.67,17.2 v52,17.54 | U$1.34 21.4,30.62 v50.12,30.62
  Bottom 0.152: v50.12,30.62 50.12,23.09 52,21.21 v52,17.54
RST  (via drill 0.3 pad 0.61)
  Top 0.152: U$1.17 41.59,22.34 42.64,22.34 v47.95,27.65
  Bottom 0.152: v47.95,27.65 47.95,31.51 51.34,34.9 | U$3.MOSI 40.53,46.74 51.34,35.92 51.34,34.9 | 51.34,34.9 57.27,34.9 58.51,33.66 W5100.5
RX1  (via drill 0.3 pad 0.61)
  Top 0.152: U$1.22 48.41,37.57 66.91,37.57 69.55,40.21 75.83,40.21 76.74,41.12 76.74,51.73 78.42,53.4 HMMOD-UART.5 | UART1.3 44.24,12.09 44.9,12.74 v45.24,12.74
  Bottom 0.152: v45.24,12.74 45.24,34.4 U$1.22
RX-MAPLE  (via drill 0.3 pad 0.61)
  Top 0.152: U$1.30 29.2,32.99 v38.77,32.99 39.08,32.68 65.16,32.68 66.41,33.92 U$2.TX0-1 70.09,36.07 v86.85,36.07
  Bottom 0.152: UART0.3 36.89,13.86 36.89,18.53 37.95,19.59 37.95,32.17 v38.77,32.99 | IC31.31 90.56,35.34 89.83,36.07 v86.85,36.07
RX_DBG
  Bottom 0.152: U$1.14 33.97,18.84 33.29,18.15 33.29,5.92 33.86,5.34 37.84,5.34 DBG.3
RX_LED  (via drill 0.3 pad 0.61)
  Top 0.152: v87.32,29.13 88.33,29.13 v91.35,32.16
  Bottom 0.152: v87.32,29.13 86.95,29.13 85.31,27.49 85.31,27.17 84.16,26.02 R32.1 | IC31.2 91.99,32.18 91.97,32.16 v91.35,32.16
SCK1  (via drill 0.3 pad 0.61)
  Top 0.152: CC_X1.4 69.85,12.42 70.78,12.42 v72.46,14.1 72.99,14.1 73.74,13.35 CC1.SCLK | CC0.SCLK 26.59,9.41 29.66,6.35 CC_X0.4 | CC2.SCLK 26.59,46.24 27.34,46.99 CC_X2.4 32.74,46.99 34.05,48.3 67.63,48.3 68.86,49.53 CC_X4.4 70.84,49.53 71.16,49.21 73.93,49.21 73.99,49.27 CC4.SCLK
  Bottom 0.152: 30.76,38.24 30.76,45.01 31.75,46 CC_X2.4 | 30.76,38.24 31.43,37.57 U$1.28 | 30.76,38.24 24.06,38.24 22.82,37 22.82,16.27 31.75,7.34 CC_X0.4 | CC_X4.4 69.85,48.54 72.05,46.34 72.05,14.52 v72.46,14.1
SCK2  (via drill 0.3 pad 0.61)
  Top 0.152: v46.75,27.49 48.62,29.36 50.54,29.36 50.73,29.54 56.94,29.54 58.51,31.11 W5100.6
  Bottom 0.152: U$3.SCLK 40.95,44.2 48.03,37.11 48.03,32.02 46.16,30.15 46.16,28.08 v46.75,27.49 46.67,27.41 U$1.19
SCK-A  (via drill 0.3 pad 0.61)
  Top 0.152: U$2.D13 88.58,35.51 71.67,35.51 v70.76,34.6
  Bottom 0.152: NRF24L01+.5 58.04,26.56 58.04,24.6 58.6,24.04 62.02,24.04 62.87,24.89 62.87,28.14 63.29,28.56 63.3,28.56 66.41,31.66 66.41,31.79 66.98,32.36 68.52,32.36 v70.76,34.6
SWCLK/TCK
  Top 0.152: CTX-DB.4 55.46,17.2 54.19,18.47 25.93,18.47 U$1.10
SWDIO/TMS
  Top 0.152: U$1.11 28.11,18.83 55.1,18.83 56.73,17.2 CTX-DB.2
SWO/TDO  (via drill 0.3 pad 0.61)
  Top 0.152: CTX-DB.6 54.19,17.2 53.99,17.2 v53.76,17.44
  Bottom 0.152: U$1.8 18.73,17.95 31.89,4.8 32.18,4.8 33.02,3.96 33.02,3.67 35.29,1.41 45.52,1.41 46.11,2 46.11,11.43 50.64,15.96 52.28,15.96 v53.76,17.44
TDI
  Top 0.152: U$1.9 23.69,18.17 52.12,18.17 52.92,17.36 52.92,17.2 CTX-DB.8
TX1
  Bottom 0.152: 43.98,35.68 39.08,40.58 36.85,40.58 36.16,41.26 36.16,47.13 37.26,48.23 52.17,48.23 59.34,55.4 HMMOD-UART.6 | 43.98,35.68 U$1.23 | UART1.2 40.6,16.52 40.6,32.29 43.98,35.68
TX-MAPLE  (via drill 0.3 pad 0.61)
  Top 0.152: 65.16,32.09 65.27,31.97 65.27,31.71 65.58,31.4 65.84,31.4 65.86,31.39 66.41,31.39 U$2.RX1-1 | U$1.31 27.52,32.12 65.12,32.12 65.16,32.09 | 65.16,32.09 65.93,32.86 89.28,32.86 v89.66,33.23 | UART0.2 36.55,16.75 v31.71,16.75
  Bottom 0.152: v89.66,33.23 89.76,33.34 IC31.30 | v31.71,16.75 32.45,17.48 32.45,27.19 U$1.31
TX_DBG
  Bottom 0.152: U$1.15 36.51,9.21 DBG.2
VCC  (via drill 0.3 pad 0.61)
  Top 0.508: U$3.VIN3.3 63.35,49.28 66.14,52.07 CC_X4.1 CC_X4.2 71.18,52.07 71.23,52.02 C4.2 72.39,53.08 73.81,54.5 73.81,55.27 CC4.VCC | v67.36,30.27 70.01,30.27 ARDU_PRG.P$2 | 63.97,24.87 62.38,23.28 56.73,23.28 CTX-DB.1 | NRF24L01+.2 63.97,24.87 | 63.97,24.87 67.69,21.15 C7.2 72.24,19.94 72.39,19.79 C2.2 73.55,18.73 73.56,18.74 73.56,19.35 CC1.VCC | DBG.1 45.09,5.11 36.75,5.11 35.46,3.81 CC_X0.1 CC_X0.2 30.58,3.81 29.1,2.33 29.1,2.31 C1.2 26.78,2.31 26.77,2.32 26.77,3.42 CC0.VCC | CC_X1.1 66.14,13.97 47.62,13.97 44.42,17.16 UART1.1 UART0.1 | U$3.VIN3.3B 57.61,46.74 56.13,45.26 36.27,45.26 35.46,44.45 CC_X2.1 CC_X2.2 31.75,42.29 31.62,42.16 C5.1 30.41,40.4 30.22,40.59 C3.2 26.78,40.59 26.78,40.26 26.77,40.24 CC2.VCC 5.51,40.24 0.95,35.69 0.95,35.52 | 0.95,35.52 0.95,33.92 1.17,33.7 1.17,32.66 C6.1 | U$1.40 0.95,35.52
  Bottom 0.508: 77.4,29.11 77.34,29.11 77.18,28.95 R34.1 76.02,27.89 74.4,26.27 74.4,14.69 72.4,12.7 | 77.4,29.11 77.4,35.32 78.11,36.02 U$2.VCC 78.11,39.45 76.79,40.76 76.79,45.4 | 77.4,29.11 C31.1 78.56,28.05 82.92,28.05 83.04,28.18 IC31.18 85.31,28.18 87.01,29.88 91.81,29.88 | 72.4,12.7 71.91,12.7 71.91,13.08 71.02,13.97 CC_X1.2 68.68,13.97 68.1,14.55 67.31,14.55 | 3V3.1 72.4,12.7 | 67.31,14.55 67.31,15.14 65.76,16.69 65.76,25.04 | CC_X1.1 67.31,14.55 | 65.76,25.04 65.76,28.82 67.21,30.27 v67.36,30.27 | 65.76,25.04 NRF24L01+.2 | IC31.4 91.81,30.58 91.81,29.88 | 91.81,29.88 91.81,28.98 IC31.6 | DBG.1 45.09,5.11 44.42,5.77 44.42,17.16 UART1.1 | CC_X4.2 71.02,52.07 71.02,51.18 76.79,45.4 | HMMOD-UART.1 76.79,45.4 | U$3.VIN3.3 57.61,49.28 57.61,46.74 U$3.VIN3.3B
VDD  (2 unrouted)
  Bottom 0.508: 77.34,6.96 75.95,5.56 1WIRE.1 | 78,7.62 77.34,6.96 | 77.34,6.96 75.41,8.89 74.92,8.89 | 74.92,8.89 74.42,9.38 3V3.2 | 5V.1 74.92,8.89 | F1.P$1 87.86,12.83 87.35,12.32 85.77,12.32 83.61,10.16 | 83.61,10.16 83.08,10.16 83.08,10.69 81.47,12.3 79.88,12.3 | R4.2 83.61,10.16 | 79.88,12.3 79.88,12.14 79.06,11.32 79.06,10.74 R1.1 | 79.88,12.3 79.88,13.34 IC1.1
WIZ_CS
  Bottom 0.152: W5100.3 55.97,33.66 55.03,34.6 53.34,34.6 49.51,30.77 49.51,22.64 49.21,22.34 U$1.20 47.45,18.82 46.23,18.82 45.64,19.41 45.64,30.37 47.69,32.42 47.69,36.97 43,41.66 U$3.NSS
WIZ_RST
  Top 0.152: U$1.16 46.82,28.36 47.07,28.36 48.37,29.66 50.42,29.66 50.6,29.85 54.7,29.85 55.97,31.11 W5100.4
  Bottom 0.152: U$3.NRESET 57.79,41.66 57.79,37.73 60.42,35.09 60.42,33.28 59.2,32.05 58.79,32.05 57.85,31.11 W5100.4

### Text on the board
tNames: +5V | GND | LAN | CS | RST | GND | VCC | MOSI | MISO | MOSI | SCK | MISO | IN | VCC | CS | OUT | GND | VCC | GND | W5100 | 5V | MAPLE CUN Large Version A 1.3 | MAPLE CUN Large Version A 1.3 | www.neuby.de | 31 (PB12) | + | TX | RX | GND | VCC | GND | GND | + | RX | TX
bNames: MAPLE CUN Lage Version A 1.3